# EAGLE design garmin-transmogrifier (EAGLE 5.06)
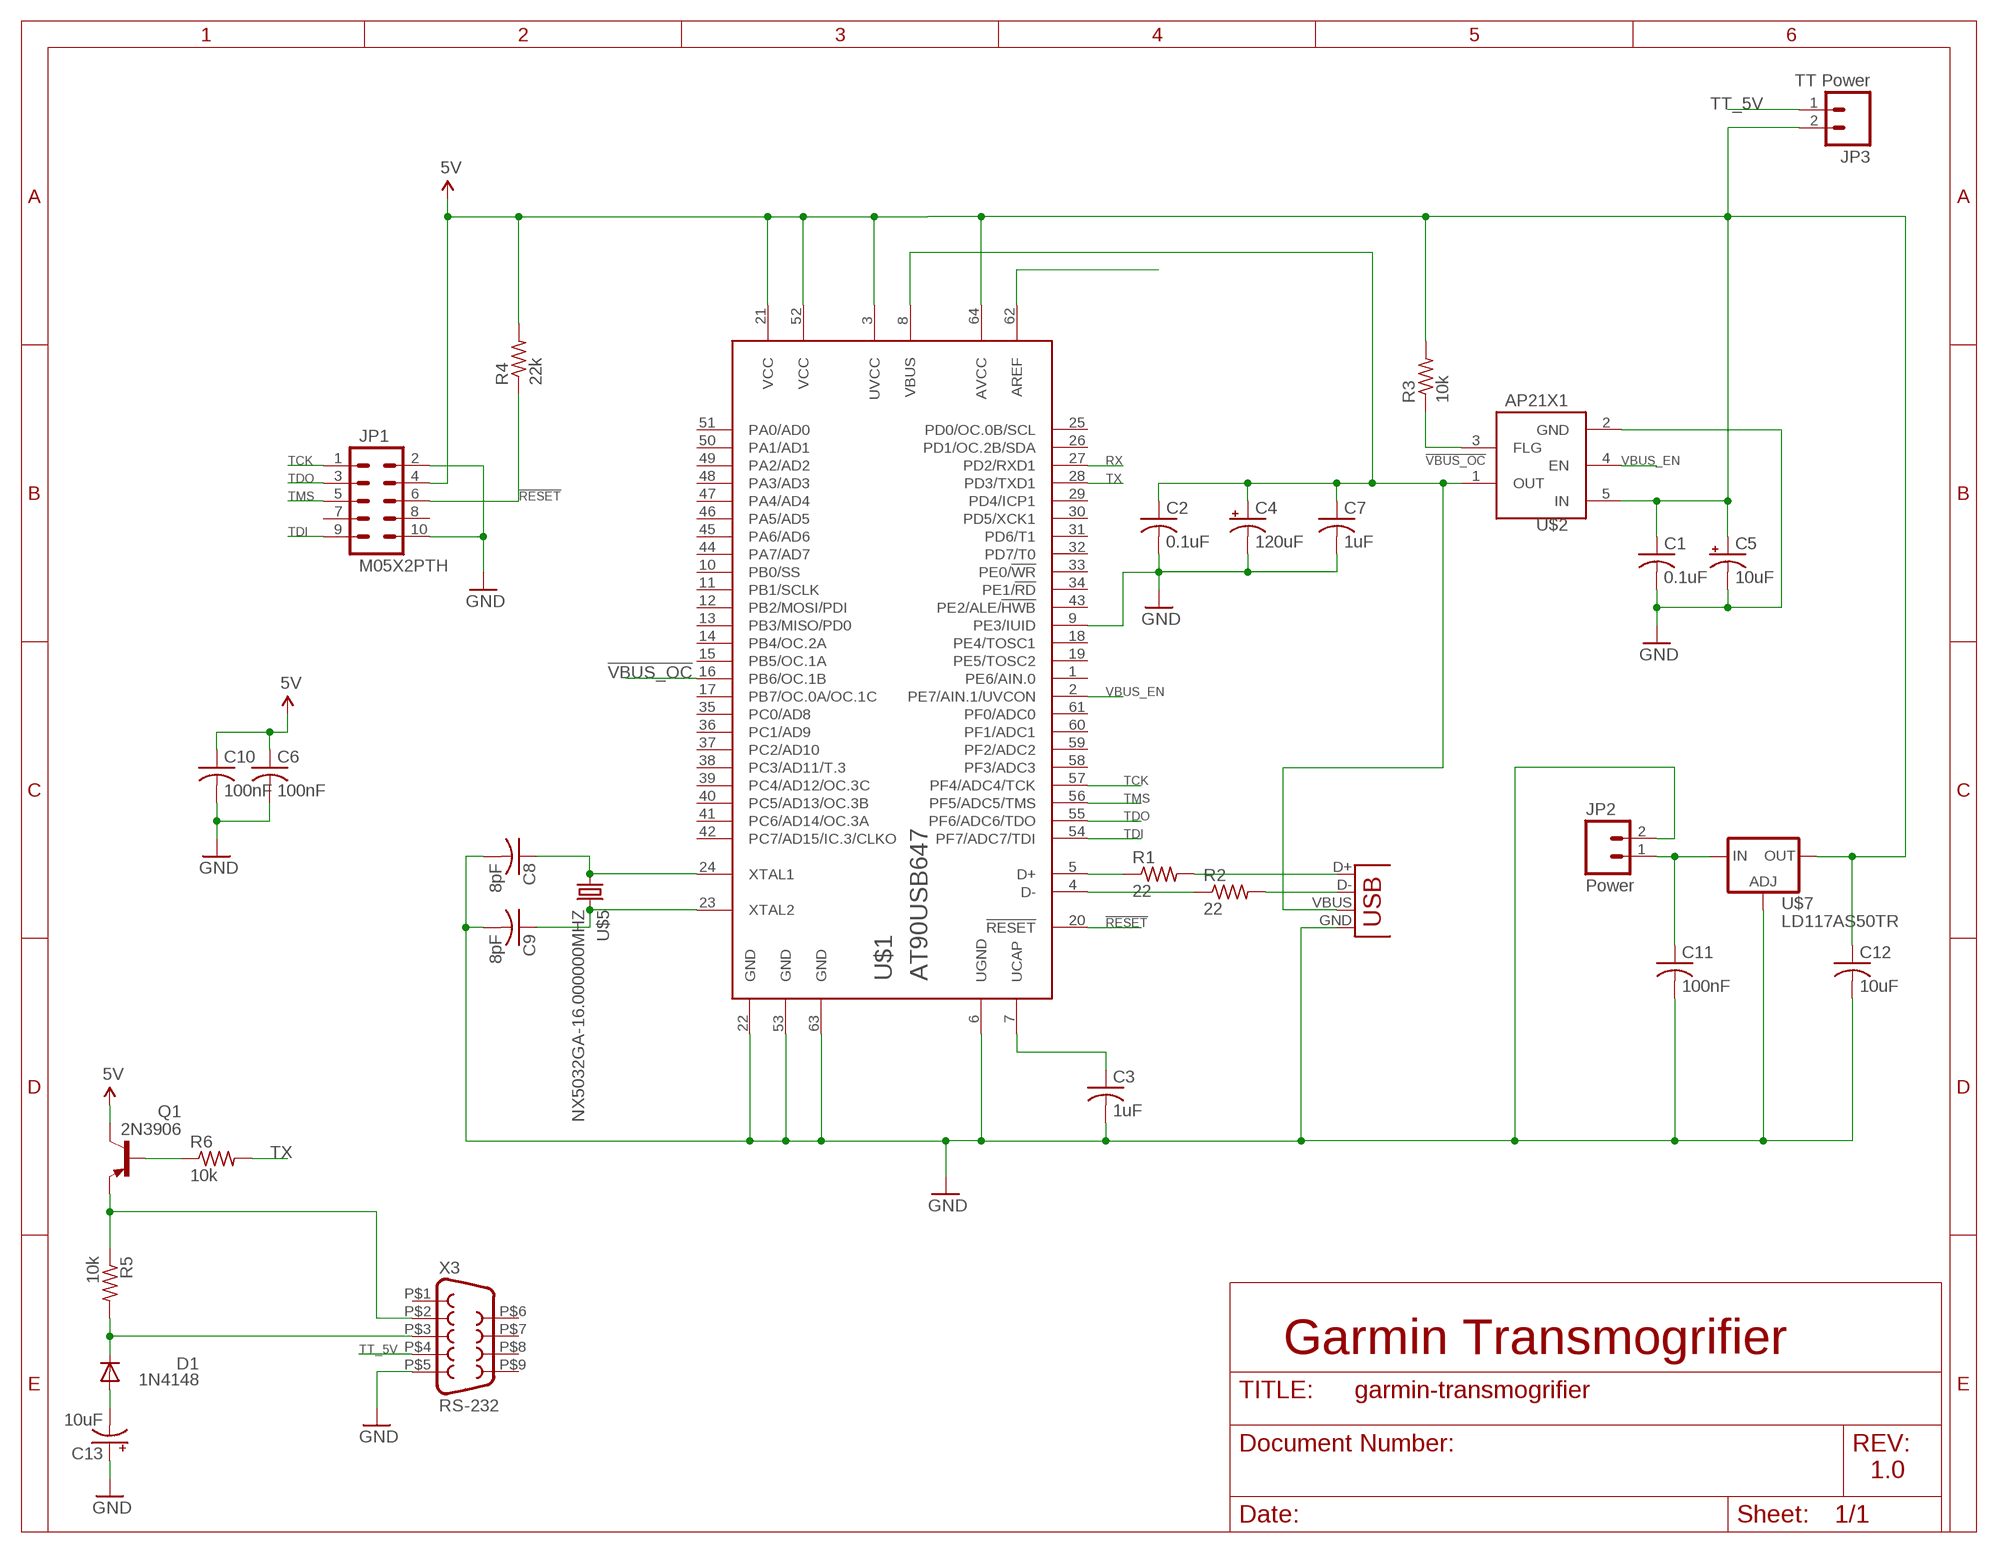
[diagram p0: schematic, sheet 1]

## Parts
C1  0.1uF  C-USC0603  [C0603]
C2  0.1uF  C-USC0603  [C0603]
C3  1uF  C-USC0603  [C0603]
C4  120uF  CPOL-USE2.5-5  [E2,5-5]
C5  10uF  CPOL-USE2.5-5  [E2,5-5]
C6  100nF  C-USC0603  [C0603]
C7  1uF  C-USC0603  [C0603]
C8  8pF  C-USC0603  [C0603]
C9  8pF  C-USC0603  [C0603]
C10  100nF  C-USC0603  [C0603]
C11  100nF  C-USC0603  [C0603]
C12  10uF  C-USC0603  [C0603]
C13  10uF  CAP_POL1206  [EIA3216]
D1  1N4148  DIODE-SOD123  [SOD123]
JP1  M05X2PTH  [AVR_ICSP]
JP2  Power  M02PTH  [1X02]
JP3  TT Power  M02PTH  [1X02]
Q1  2N3906  -PNP-SOT23-BCE  [SOT23-BCE]
R1  22  R-US_R0603  [R0603]
R2  22  R-US_R0603  [R0603]
R3  10k  R-US_R0603  [R0603]
R4  22k  R-US_R0603  [R0603]
R5  10k  R-US_R0603  [R0603]
R6  10k  R-US_R0603  [R0603]
U$1  AT90USB647  [ATMEL-MD-TQFP64]
U$2  AP21X1  [SOT25]
U$5  NX5032GA-16.000000MHZ  [5.0MM-X-3.2MM]
U$7  LD117AS50TR  [SOT223]
X1  USB-A-S  [USB-A-S]
X3  RS-232  DB9SANDWICH  [DB9-SANDWICH]

## Nets
5V: C1.1 C5.+ C6.1 C10.1 C12.1 JP1.4 JP3.2 Q1.C R3.2 R4.2 U$1.3(UVCC) U$1.21(VCC) U$1.52(VCC) U$1.64(AVCC) U$2.5(IN) U$7.4(OUT)
!RESET: JP1.6 R4.1 U$1.20(!RESET)
!VBUS_OC: R3.1 U$1.16(PB6/OC.1B) U$2.3(FLG)
GND: C1.2 C2.2 C3.2 C4.- C5.- C6.2 C7.2 C8.2 C9.2 C10.2 C11.2 C12.2 C13.A(+) JP1.2 JP1.10 JP2.2 U$1.6(UGND) U$1.9(PE3/IUID) U$1.22(GND) U$1.53(GND) U$1.63(GND) U$2.2(GND) U$7.1(ADJ) X1.GND X3.P$5
N$2: C3.1 U$1.7(UCAP)
N$3: C8.1 U$1.24(XTAL1) U$5.P$1
N$4: R1.1 U$1.5(D+)
N$5: R2.1 U$1.4(D-)
N$6: R2.2 X1.D-
N$7: R1.2 X1.D+
N$8: C9.1 U$1.23(XTAL2) U$5.P$2
N$9: C13.C(-) D1.A
N$10: U$1.62(AREF)
N$11: C11.1 JP2.1 U$7.3(IN)
N$12: D1.C R5.2 X3.P$3
N$13: Q1.B R6.1
N$14: Q1.E R5.1 X3.P$2
RX: U$1.27(PD2/RXD1)
TCK: JP1.1 U$1.57(PF4/ADC4/TCK)
TDI: JP1.9 U$1.54(PF7/ADC7/TDI)
TDO: JP1.3 U$1.55(PF6/ADC6/TDO)
TMS: JP1.5 U$1.56(PF5/ADC5/TMS)
TT_5V: JP3.1 X3.P$4
TX: R6.2 U$1.28(PD3/TXD1)
VBUS: C2.1 C4.+ C7.1 U$1.8(VBUS) U$2.1(OUT) X1.VBUS
VBUS_EN: U$1.2(PE7/AIN.1/UVCON) U$2.4(EN)
Unconnected: JP1.7 JP1.8 U$1.1(PE6/AIN.0) U$1.10(PB0/SS) U$1.11(PB1/SCLK) U$1.12(PB2/MOSI/PDI) U$1.13(PB3/MISO/PD0) U$1.14(PB4/OC.2A) U$1.15(PB5/OC.1A) U$1.17(PB7/OC.0A/OC.1C) U$1.18(PE4/TOSC1) U$1.19(PE5/TOSC2) U$1.25(PD0/OC.0B/SCL) U$1.26(PD1/OC.2B/SDA) U$1.29(PD4/ICP1) U$1.30(PD5/XCK1) U$1.31(PD6/T1) U$1.32(PD7/T0) U$1.33(PE0/!WR) U$1.34(PE1/!RD) U$1.35(PC0/AD8) U$1.36(PC1/AD9) U$1.37(PC2/AD10) U$1.38(PC3/AD11/T.3) U$1.39(PC4/AD12/OC.3C) U$1.40(PC5/AD13/OC.3B) U$1.41(PC6/AD14/OC.3A) U$1.42(PC7/AD15/IC.3/CLKO) U$1.43(PE2/ALE/!HWB) U$1.44(PA7/AD7) U$1.45(PA6/AD6) U$1.46(PA5/AD5) U$1.47(PA4/AD4) U$1.48(PA3/AD3) U$1.49(PA2/AD2) U$1.50(PA1/AD1) U$1.51(PA0/AD0) U$1.58(PF3/ADC3) U$1.59(PF2/ADC2) U$1.60(PF1/ADC1) U$1.61(PF0/ADC0) X3.P$1 X3.P$6 X3.P$7 X3.P$8 X3.P$9

## Notes on the sheet
- Garmin Transmogrifier
- 1.0

## Library data of the parts
C1-C3 C6-C12 = rcl:C-US: CAPACITOR, American symbol
C4 C5 = rcl:CPOL-US: POLARIZED CAPACITOR, American symbol
C13 = SparkFun:CAP_POL: Capacitor Polarized These are standard SMD and PTH capacitors. Normally 10uF, 47uF, and 100uF in electrolytic and tantalum varieties. Always verify the external diameter of the through hole cap, it varies with capacity, voltage, and manufacturer. The EIA devices should be standard.
D1 = diode:DIODE-: DIODE
JP1 = SparkFun:M05X2: Header 5x2 Standard 10-pin dual row 0.1" header. Commonly used with AVR-ISP. Use with Spark Fun Electronics SKU: PRT-00778
JP2 JP3 = SparkFun:M02: Header 2 Standard 2-pin 0.1" header. Use with straight break away headers (SKU : PRT-00116), right angle break away headers (PRT-00553), swiss pins (PRT-00743), machine pins (PRT-00117), and female headers (PRT-00115). Molex polarized connector foot print use with SKU : PRT-08233 with associated crimp pins and housings.
Q1 = transistor:*-PNP-: PNP Transistror
R1-R6 = rcl:R-US_: RESISTOR, American symbol
U$1 = STUNTAZ:AT90USB647: 8-bit AVR Microcontroller with 64/128K Bytes of ISP Flash and USB Controller, capable of USB OTG
U$2 = STUNTAZ:AP21X1: The AP2141 and AP2151 are integrated high-side power switches optimized for Universal Serial Bus (USB) and other hot-swap applications. The family of devices complies with USB 2.0 and available with both polarities of Enable input. They offer current and thermal limiting and short circuit protection as well as controlled rise time and under-voltage lockout functionality. A 7ms deglitch capability on the open-drain Flag output prevents false over-current reporting and does not require any external components.
U$5 = fletchtronics:NX5032GA-16.000000MHZ
U$7 = v-reg:LD117A?*: Low drop fixed and adjustable positive voltage regulators 1 A Source: http://www.st.com/stonline/products/literature/ds/7194/ld1117axx.pdf
X1 = SparkFun:USB: USB Connectors USB-B-PTH is fully proven SKU : PRT-00139 USB-miniB is fully proven SKU : PRT-00587 USB-A-PCB is untested. USB-A-H is throughly reviewed, but untested. Spark Fun Electronics SKU : PRT-00437 USB-B-SMT is throughly reviewed, but untested. Needs silkscreen touching up. USB-A-S has not been used/tested USB-MB-H has not been used/tested
X3 = nall:DB9: DB9 Connector Standard DB9 (D-Sub 9) serial connector. Can be used for CAN bus as well as RS485 and RS232. Footprint production proven. Spark Fun Electronics SKU : PRT-00429

## Board
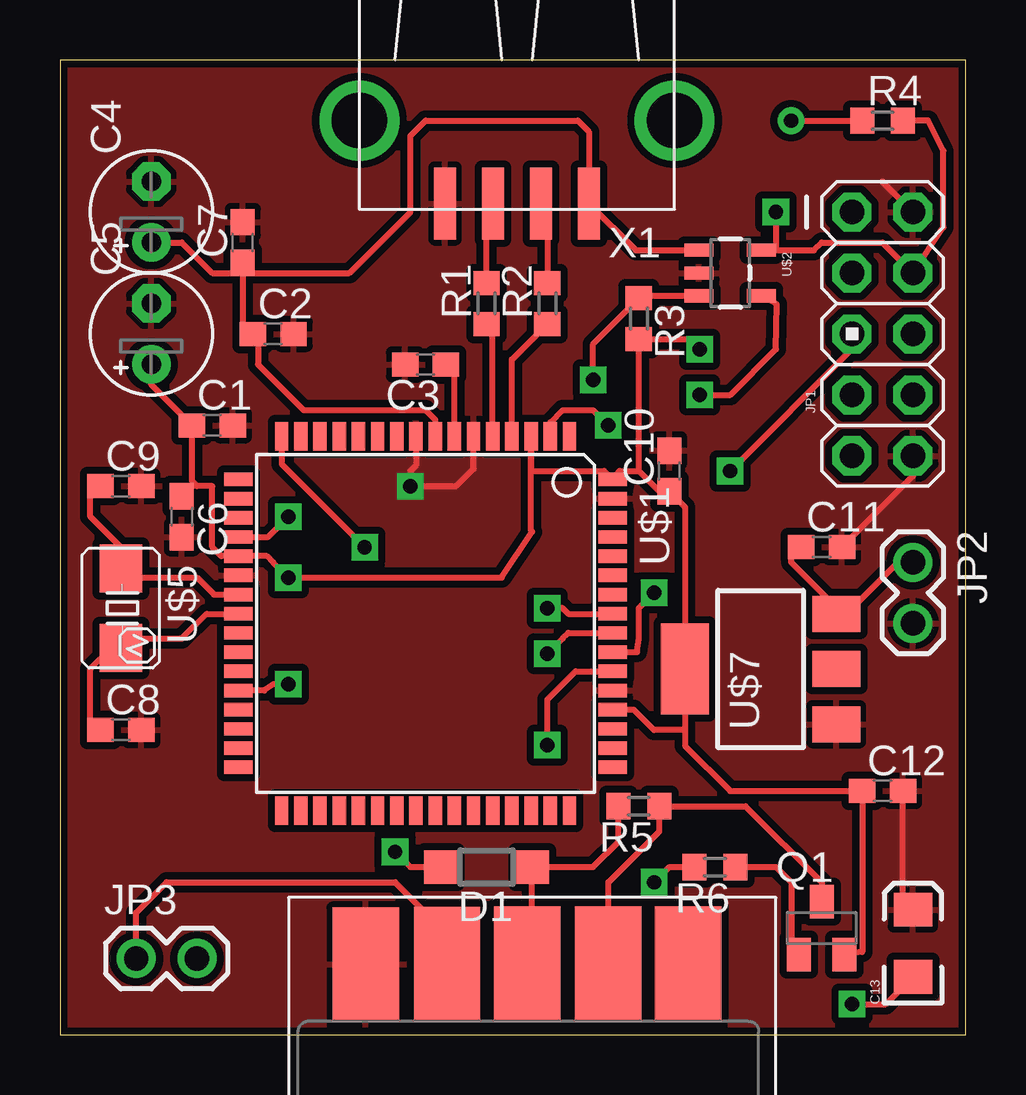
[diagram p1: board, top side]
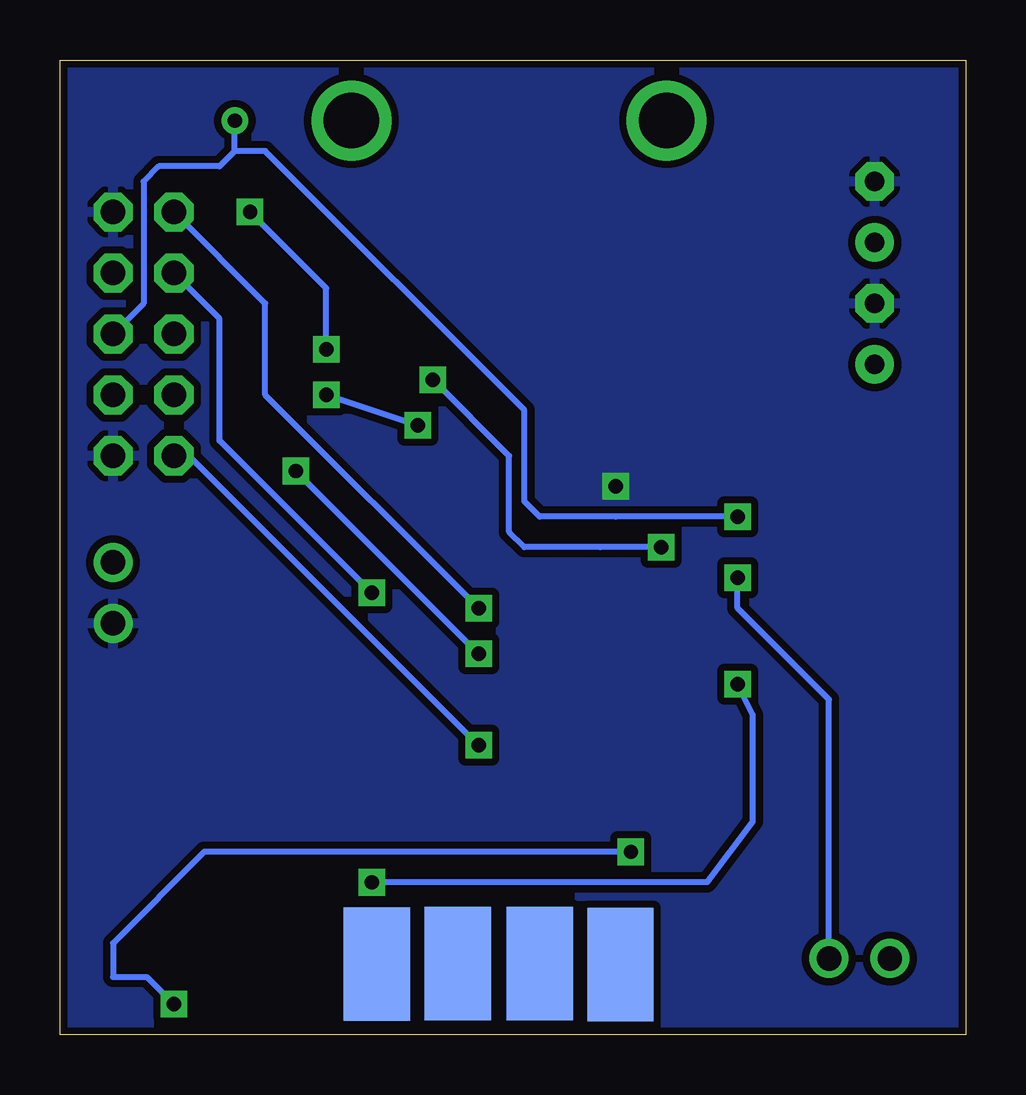
[diagram p2: board, bottom side, seen from below]

Size 37.77 x 40.63 mm. Coordinates in mm from the lower left corner, seen from the top.
Outline: 0,0 37.77,0 37.77,40.63 0,40.63 0,0
Copper layers (1*16): Top 0.035mm / dielectric 1.5mm / Bottom 0.035mm
Design rules "SparkFun": minimum track width 8mil, minimum drill 20mil, track to track 8mil, track to pad 8mil, pad to pad 8mil, via to via 8mil, smd to smd 8mil, copper to edge 10mil, drill to drill 8mil, minimum pad ring 12mil, minimum via ring 10mil, stop-mask expansion 4mil, vias tented up to drill 25mil, thermal gap 10mil

### Footprints (pad centres in the part's own frame; a part is rotated, then mirrored left to right if it is on the bottom)
C0603 = smd 1.1 x 1: 1 -0.85,0; 2 0.85,0
E2,5-5 = drill 0.813 pad 1.6 round: + -1.27,0 | drill 0.813 pad 1.6 octagon: - 1.27,0
EIA3216 = smd 1.4 x 1.6: A 1.4,0; C -1.4,0
SOD123 = smd 1.4 x 1.4: A 1.9,0; C -1.9,0
AVR_ICSP = drill 1.016 octagon: 1 -1.27,5.08; 2 1.27,5.08; 3 -1.27,2.54; 4 1.27,2.54; 5 -1.27,0; 6 1.27,0; 7 -1.27,-2.54; 8 1.27,-2.54; 9 -1.27,-5.08; 10 1.27,-5.08
1X02 = drill 1.016 round: 1 0,0; 2 2.54,0
SOT23-BCE = smd 1 x 1.4: B -0.95,-1.1; C 0.95,-1.1; E 0,1.1
R0603 = smd 1 x 1.1: 1 -0.85,0; 2 0.85,0
ATMEL-MD-TQFP64 = smd 1.194 x 0.559: 1 -7.8,6; 2 -7.8,5.2; 3 -7.8,4.4; 4 -7.8,3.6; 5 -7.8,2.8; 6 -7.8,2; 7 -7.8,1.2; 8 -7.8,0.4; 9 -7.8,-0.4; 10 -7.8,-1.2; 11 -7.8,-2; 12 -7.8,-2.8; 13 -7.8,-3.6; 14 -7.8,-4.4; 15 -7.8,-5.2; 16 -7.8,-6; 33 7.8,-6; 34 7.8,-5.2; 35 7.8,-4.4; 36 7.8,-3.6; 37 7.8,-2.8; 38 7.8,-2; 39 7.8,-1.2; 40 7.8,-0.4; 41 7.8,0.4; 42 7.8,1.2; 43 7.8,2; 44 7.8,2.8; 45 7.8,3.6; 46 7.8,4.4; 47 7.8,5.2; 48 7.8,6 | smd 0.559 x 1.194: 17 -6,-7.8; 18 -5.2,-7.8; 19 -4.4,-7.8; 20 -3.6,-7.8; 21 -2.8,-7.8; 22 -2,-7.8; 23 -1.2,-7.8; 24 -0.4,-7.8; 25 0.4,-7.8; 26 1.2,-7.8; 27 2,-7.8; 28 2.8,-7.8; 29 3.6,-7.8; 30 4.4,-7.8; 31 5.2,-7.8; 32 6,-7.8; 49 6,7.8; 50 5.2,7.8; 51 4.4,7.8; 52 3.6,7.8; 53 2.8,7.8; 54 2,7.8; 55 1.2,7.8; 56 0.4,7.8; 57 -0.4,7.8; 58 -1.2,7.8; 59 -2,7.8; 60 -2.8,7.8; 61 -3.6,7.8; 62 -4.4,7.8; 63 -5.2,7.8; 64 -6,7.8
SOT25 = smd 0.55 x 1.2: 1 -0.95,-1.3; 2 0,-1.3; 3 0.95,-1.3; 4 0.95,1.3; 5 -0.95,1.3
5.0MM-X-3.2MM = smd 1.778 x 2: P$1 0,1.656; P$2 0,-1.656
SOT223 = smd 1.5 x 2: 1 -2.3,-3.15; 2 0,-3.15; 3 2.3,-3.15 | smd 3.8 x 2: 4 0,3.15
USB-A-S = smd 3 x 0.9: D+ 3.45,-1; D- 3.45,1; GND 3.45,-3; VBUS 3.45,3 | drill 2.311 round: P$5 0,-6.566; P$6 0,6.566
DB9-SANDWICH = smd 2.769 x 4.724: P$1 8.74,-6.8; P$2 12.08,-6.8; P$3 15.45,-6.8; P$4 18.79,-6.78; P$5 22.18,-6.75 | smd 2.769 x 4.724 bottom: P$6 10.36,-6.75; P$7 13.74,-6.78; P$8 17.16,-6.77; P$9 20.52,-6.73

### Placement (x,y rotation side)
C1  6.35,25.4 0 top
C2  8.89,29.21 0 top
C3  15.24,27.94 180 top
C4  3.81,34.29 90 top
C5  3.81,29.21 90 top
C6  5.08,21.59 270 top
C7  7.62,33.02 90 top
C8  2.54,12.7 0 top
C9  2.54,22.86 0 top
C10  25.4,23.5 90 top
C11  31.75,20.32 0 top
C12  34.29,10.16 0 top
C13  35.56,3.81 90 top
D1  17.78,6.99 180 top
JP1  34.29,29.21 0 top
JP2  35.56,19.68 270 top
JP3  3.17,3.17 0 top
Q1  31.75,4.45 0 top
R1  17.78,30.48 90 top
R2  20.32,30.48 90 top
R3  24.13,29.84 270 top
R4  34.29,38.1 0 top
R5  24.13,9.53 180 top
R6  27.3,6.99 180 top
U$1  15.24,17.14 270 top
U$2  27.94,31.75 270 top
U$5  2.54,17.78 180 top
U$7  29.21,15.24 90 top
X1  19.05,38.1 270 top
X3  34.92,-3.81 180 top

### Tracks (layer width: path | path; a pad name or v marks a point on that pad's centre or on a via)
5V  (via drill 0.6)
  Top 0.254: 5.71,22.86 6.35,22.86 6.35,20.32 6.72,19.95 U$1.21 8.63,19.95 8.89,19.68 v9.53,19.05 18.41,19.05 19.68,20.95 19.64,21 19.64,23.45 U$1.3 19.64,23.54 19.68,23.5 22.69,23.5 U$1.64 23.32,23.5 24.13,23.5 | 5.71,22.86 5.5,22.86 C6.1 | R4.2 36.2,38.1 36.83,36.83 36.83,33.66 JP1.4 34.29,33.02 31.75,33.02 31.43,32.7 29.84,32.7 | 29.84,32.7 U$2.5 | 26.06,12.7 26.06,12.04 27.94,10.16 C12.1 33.44,3.45 Q1.C | 26.06,12.7 U$7.4 26.06,21.98 C10.1 24.98,22.64 24.13,23.5 | 24.13,23.5 R3.2 26.25,29 v26.67,28.57 | C5.+ 3.81,27.09 C1.1 5.5,23.07 5.71,22.86 | U$1.52 23.92,13.54 24.77,12.7 26.06,12.7 | v29.84,34.29 29.84,32.7
  Bottom 0.254: JP3.2 5.71,13.97 9.53,17.78 v9.53,19.05 | v26.67,28.57 26.67,31.11 v29.84,34.29
!RESET  (via drill 0.6)
  Top 0.254: v30.48,38.1 R4.1 | U$1.20 8.68,20.75 v9.53,21.59
  Bottom 0.254: 30.48,36.83 v30.48,38.1 | 30.48,36.83 31.11,36.2 33.66,36.2 34.29,35.56 34.29,30.48 JP1.6 | v9.53,21.59 14.61,21.59 17.78,21.59 18.41,22.23 18.41,24.13 18.41,26.04 29.21,36.83 30.48,36.83
!VBUS_OC  (via drill 0.6)
  Top 0.254: U$2.3 26.57,30.8 24.23,30.8 R3.1 22.23,28.79 v22.23,27.3 | U$1.16 9.24,24.41 9.24,23.78 v12.7,20.32
  Bottom 0.254: v12.7,20.32 15.24,20.32 18.41,20.32 19.05,20.95 19.05,24.13 v22.23,27.3
GND  (via drill 0.6)
  Top 0.254: JP1.2 34.29,35.56 | JP1.10 35.56,23.28 C11.2 | C12.2 35.14,5.63 C13.A | U$1.9 14.84,23.73 14.61,23.5 v14.61,22.86 16.51,22.86 17.24,23.59 U$1.6
  pour Bottom (isolate 0.305): 0,40.64 38.1,40.64 38.1,0 0,0
  pour Top (isolate 0.305): 0,40.64 38.1,40.64 38.1,0 0,0
N$2
  Top 0.254: U$1.7 16.44,27.59 C3.1
N$3
  Top 0.254: U$1.24 6.12,17.55 5.08,16.51 2.93,16.51 U$5.P$1 2.15,16.12 1.27,15.24 1.27,13.12 C8.1
N$4
  Top 0.254: U$1.5 18.04,29.37 R1.1
N$5
  Top 0.254: U$1.4 18.84,28.15 R2.1
N$6
  Top 0.254: R2.2 20.32,34.38 X1.D-
N$7
  Top 0.254: R1.2 17.78,34.38 X1.D+
N$8
  Top 0.254: U$1.23 6.42,18.34 5.71,19.05 2.93,19.05 U$5.P$2 2.54,20.32 1.27,21.59 1.27,22.44 C9.1
N$9  (via drill 0.6)
  Top 0.254: D1.A 14.61,6.99 v13.97,7.62 | v33.02,1.27 34.42,1.27 C13.C
  Bottom 0.254: v13.97,7.62 31.75,7.62 35.56,3.81 C13.C 34.16,2.41 v33.02,1.27
N$11
  Top 0.254: JP2.1 34.92,19.68 32.78,17.54 U$7.3 32.36,17.8 30.48,19.68 30.48,19.9 C11.1
N$12
  Top 0.254: 19.69,3.21 X3.P$3 19.68,3.19 D1.C 22.23,6.99 23.28,8.04 R5.2
N$13
  Top 0.254: R6.1 29.84,6.99 30.48,6.35 30.48,3.67 Q1.B
N$14
  Top 0.254: Q1.E 31.75,6.35 28.57,9.53 R5.1 24.98,8.47 24.13,7.62 22.86,6.35 22.86,5.71 22.86,3 X3.P$2
TCK  (via drill 0.6)
  Top 0.254: v20.32,17.78 20.95,17.78 21.19,17.55 U$1.57
  Bottom 0.254: JP1.1 29.21,30.48 29.21,26.67 v20.32,17.78
TDI  (via drill 0.6)
  Top 0.254: v20.32,12.06 20.32,13.97 20.95,14.61 21.5,15.14 U$1.54
  Bottom 0.254: JP1.9 32.38,24.13 v20.32,12.06
TDO  (via drill 0.6)
  Top 0.254: U$1.55 24.06,15.95 24.13,16.51 24.13,17.78 v24.77,18.41
  Bottom 0.254: v24.77,18.41 31.11,24.77 31.11,29.84 JP1.3
TMS  (via drill 0.6)
  Top 0.254: JP1.5 33.02,28.57 v27.94,23.5 | v20.32,15.88 20.95,16.51 21.19,16.75 U$1.56
  Bottom 0.254: v20.32,15.88 v27.94,23.5
TT_5V
  Top 0.254: X3.P$4 16.14,4.18 13.97,6.35 4.45,6.35 3.17,5.08 JP3.1
TX  (via drill 0.6)
  Top 0.254: v9.53,14.61 8.89,14.61 8.52,14.35 U$1.28 | R6.2 25.4,6.99 v24.77,6.35
  Bottom 0.254: v24.77,6.35 10.79,6.35 8.89,8.89 8.89,13.34 v9.53,14.61
VBUS
  Top 0.254: C4.+ 5.08,33.02 6.35,31.75 7.2,31.75 C7.1 | C7.1 7.62,29.63 C2.1 8.26,29 8.26,27.94 10.16,26.04 15.24,26.04 15.64,25.64 U$1.8 | U$2.1 24,32.7 X1.VBUS 22.05,37.64 21.59,38.1 15.24,38.1 14.61,37.47 14.61,34.29 12.06,31.75 8.04,31.75 C7.1
VBUS_EN  (via drill 0.6)
  Top 0.254: U$1.2 20.44,25.52 20.95,26.04 22.23,26.04 v22.86,25.4 | v26.67,26.67 27.94,26.67 29.84,28.57 29.88,30.45 U$2.4
  Bottom 0.254: v22.86,25.4 v26.67,26.67